# EAGLE schematic sensorboard (EAGLE 5.03)
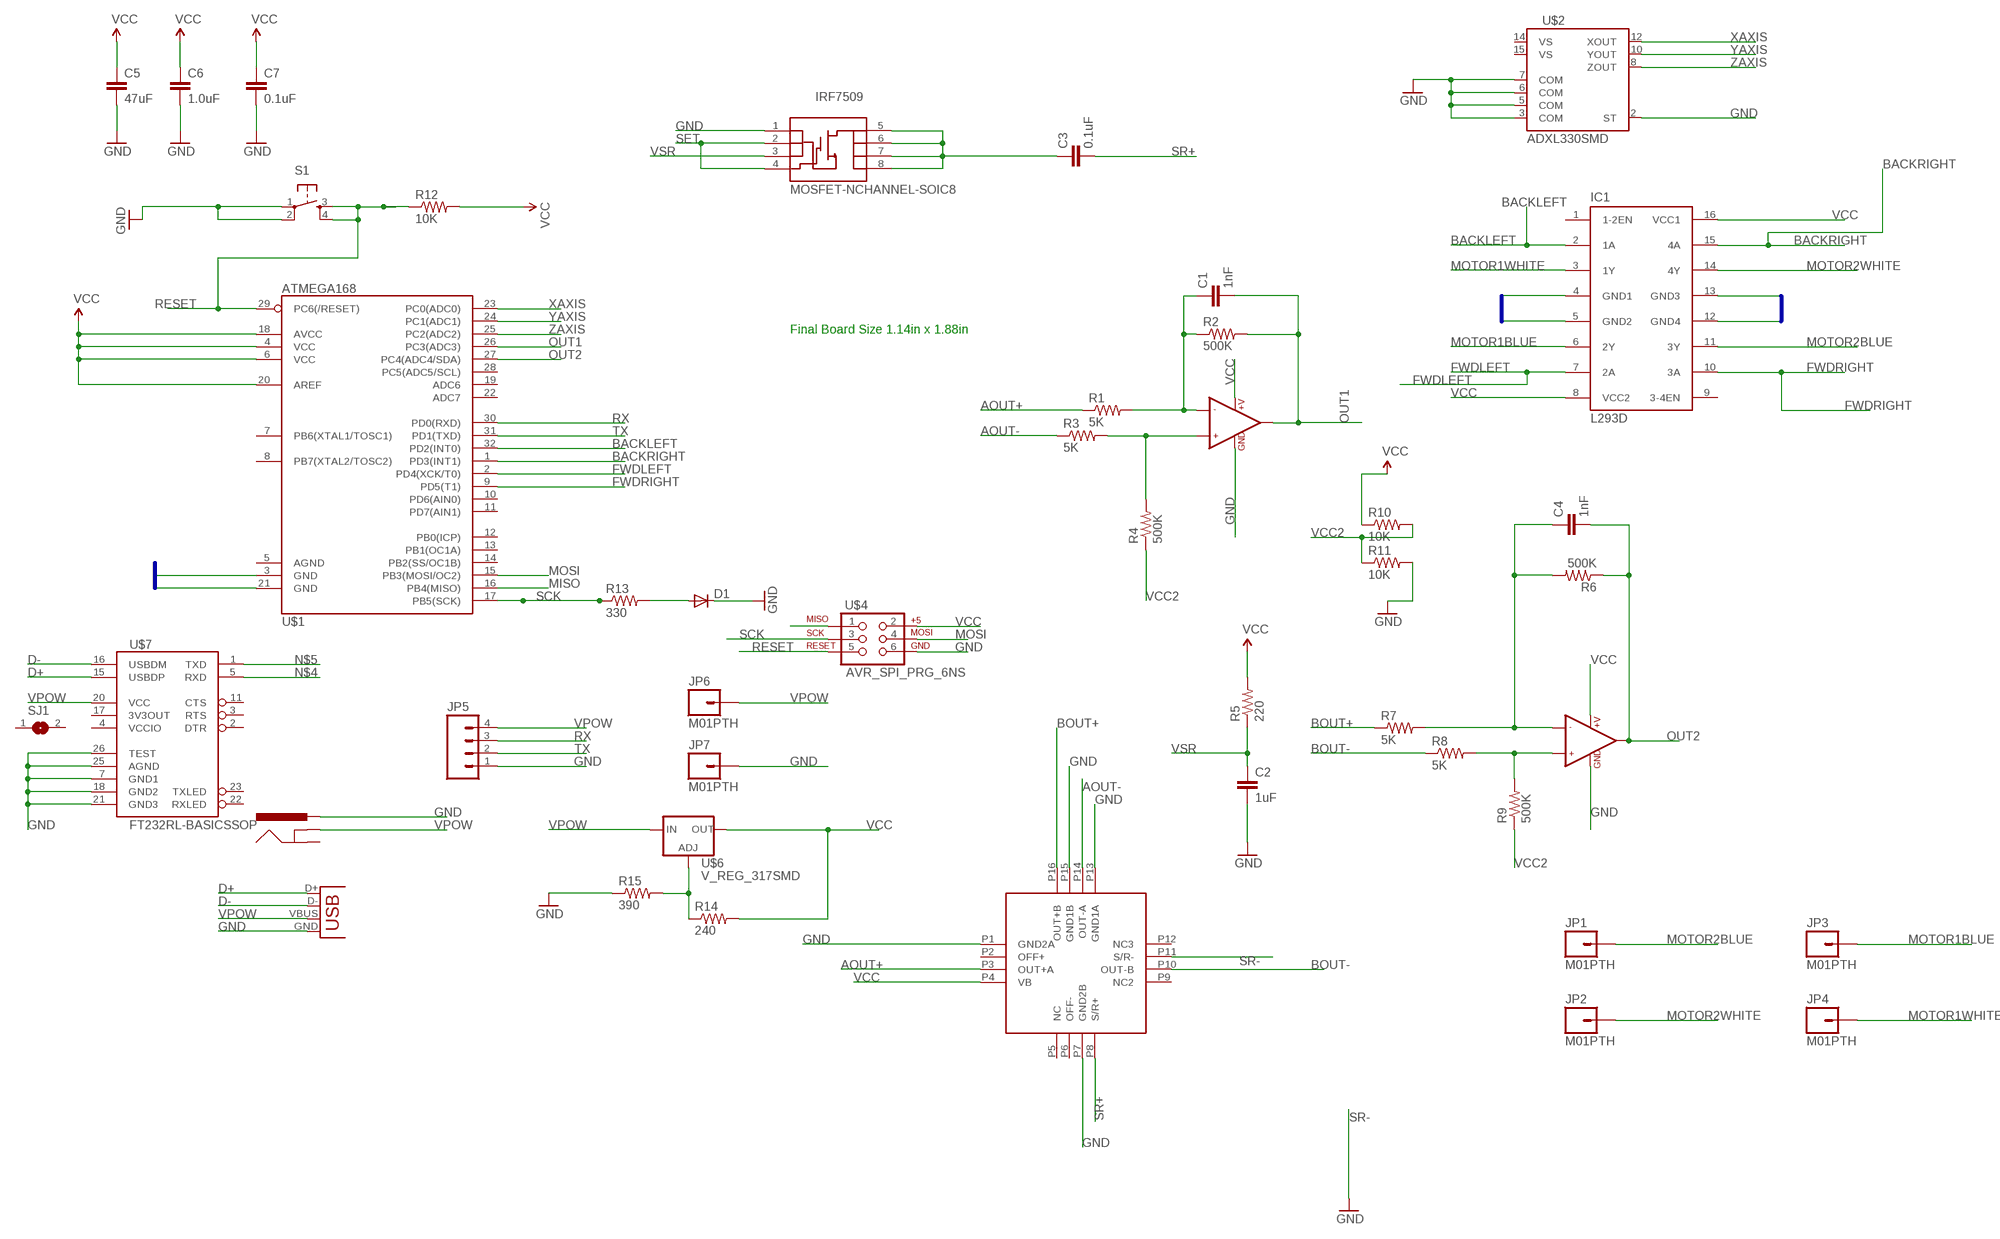
[diagram p0: schematic, sheet 1]

## Parts
C1  1nF  CAP0805  [0805]
C2  1uF  CAP0805  [0805]
C3  0.1uF  CAP0603  [0603]
C4  1nF  CAP0603  [0603]
C5  47uF  CAP0805  [0805]
C6  1.0uF  CAP0805  [0805]
C7  0.1uF  CAP0805  [0805]
D1  DIODESOT23  [SOT23-3]
IC1  L293D  [DIL16]
IRF7509  MOSFET-NCHANNEL-SOIC8  [SO08]
J1  POWER_JACKCOMBO  [POWER_JACK_COMBO]
JP1  M01PTH  [1X01]
JP2  M01PTH  [1X01]
JP3  M01PTH  [1X01]
JP4  M01PTH  [1X01]
JP5  M04PTH  [1X04]
JP6  M01PTH  [1X01]
JP7  M01PTH  [1X01]
LMV351$1  LMV358  [SO08]
R1  5K  RESISTOR1206  [1206]
R2  500K  RESISTOR1206  [1206]
R3  5K  RESISTOR1206  [1206]
R4  500K  RESISTOR1206  [1206]
R5  220  RESISTOR1206  [1206]
R6  500K  RESISTOR1206  [1206]
R7  5K  RESISTOR1206  [1206]
R8  5K  RESISTOR1206  [1206]
R9  500K  RESISTOR1206  [1206]
R10  10K  RESISTOR1206  [1206]
R11  10K  RESISTOR1206  [1206]
R12  10K  RESISTOR1206  [1206]
R13  330  RESISTOR1206  [1206]
R14  240  RESISTOR1206  [1206]
R15  390  RESISTOR1206  [1206]
S1  TAC_SWITCHSMD  [TACTILE_SWITCH_SMD]
SJ1  SJ  [SJ]
U$1  ATMEGA168  [TQFP32-08]
U$2  ADXL330SMD  [LFCSP-16]
U$3  HMC1052L  [16LPCC]
U$4  AVR_SPI_PRG_6NS  [2X3-NS]
U$5  LMV358  [SO08]
U$6  V_REG_317SMD  [SOT223]
U$7  FT232RL-BASICSSOP  [SSOP28DB]
X1  USBSMD  [USB-MINIB]

## Nets
AOUT+: R1.1 U$3.P3(OUT+A)
AOUT-: R3.1 U$3.P14(OUT-A)
BACKLEFT: IC1.2(1A) U$1.32(PD2(INT0))
BACKRIGHT: IC1.15(4A) U$1.1(PD3(INT1))
BOUT+: R7.1 U$3.P16(OUT+B)
BOUT-: R8.1 U$3.P10(OUT-B)
D+: U$7.15(USBDP) X1.D+
D-: U$7.16(USBDM) X1.D-
FWDLEFT: IC1.7(2A) U$1.2(PD4(XCK/T0))
FWDRIGHT: IC1.10(3A) U$1.9(PD5(T1))
GND: C2.2 C5.2 C6.2 C7.2 D1.3(C) IC1.4(GND1) IC1.5(GND2) IC1.12(GND4) IC1.13(GND3) IRF7509.1(S) J1.POWER(PWR) JP5.1 JP7.1 LMV351$1.4(GND) R11.2 R15.1 S1.1 S1.2 U$1.3(GND) U$1.21(GND) U$2.2(ST) U$2.3(COM) U$2.5(COM) U$2.6(COM) U$2.7(COM) U$3.P1(GND2A) U$3.P7(GND2B) U$3.P13(GND1A) U$3.P15(GND1B) U$4.6 U$5.4(GND) U$7.7(GND1) U$7.18(GND2) U$7.21(GND3) U$7.25(AGND) U$7.26(TEST) X1.GND
LMV358: C1.1 LMV351$1.2(-IN1) R1.2 R2.1
MISO: U$1.16(PB4(MISO)) U$4.1
MOSI: U$1.15(PB3(MOSI/OC2)) U$4.4
MOTOR1BLUE: IC1.6(2Y) JP3.1
MOTOR1WHITE: IC1.3(1Y) JP4.1
MOTOR2BLUE: IC1.11(3Y) JP1.1
MOTOR2WHITE: IC1.14(4Y) JP2.1
N$1: D1.1(A) R13.2
N$3: R14.1 R15.2 U$6.1(ADJ)
N$4: U$7.5(RXD)
N$5: U$7.1(TXD)
N$6: C3.1 IRF7509.5(D) IRF7509.6(D) IRF7509.7(D) IRF7509.8(D)
N$7: C4.1 R6.2 R7.2 U$5.2(-IN1)
N$8: LMV351$1.3(+IN1) R3.2 R4.2
N$9: R8.2 R9.2 U$5.3(+IN1)
OUT1: C1.2 LMV351$1.1(OUT1) R2.2 U$1.26(PC3(ADC3))
OUT2: C4.2 R6.1 U$1.27(PC4(ADC4/SDA)) U$5.1(OUT1)
RESET: R12.1 S1.3 S1.4 U$1.29(PC6(/RESET)) U$4.5
RX: JP5.3 U$1.30(PD0(RXD))
SCK: R13.1 U$1.17(PB5(SCK)) U$4.3
SET: IRF7509.2(S) IRF7509.4(G)
SR+: C3.2 U$3.P8(S/R+)
SR-: U$3.P11(S/R-) ; supply symbol labelled GND
TX: JP5.2 U$1.31(PD1(TXD))
VCC: C5.1 C6.1 C7.1 IC1.8(VCC2) IC1.16(VCC1) LMV351$1.8(+V) R5.2 R10.1 R12.2 R14.2 U$1.4(VCC) U$1.6(VCC) U$1.18(AVCC) U$1.20(AREF) U$3.P4(VB) U$4.2 U$5.8(+V) U$6.2(OUT)
VCC2: R4.1 R9.1 R10.2 R11.1
VPOW: J1.GND(GNDBREAK) JP5.4 JP6.1 U$6.3(IN) U$7.20(VCC) X1.VBUS
VSR: C2.1 IRF7509.3(S) R5.1
XAXIS: U$1.23(PC0(ADC0)) U$2.12(XOUT)
YAXIS: U$1.24(PC1(ADC1)) U$2.10(YOUT)
ZAXIS: U$1.25(PC2(ADC2)) U$2.8(ZOUT)
Unconnected: IC1.1(1-2EN) IC1.9(3-4EN) J1.GND@1(GND) LMV351$1.5(+IN2) LMV351$1.6(-IN2) LMV351$1.7(OUT2) SJ1.1 SJ1.2 U$1.5(AGND) U$1.7(PB6(XTAL1/TOSC1)) U$1.8(PB7(XTAL2/TOSC2)) U$1.10(PD6(AIN0)) U$1.11(PD7(AIN1)) U$1.12(PB0(ICP)) U$1.13(PB1(OC1A)) U$1.14(PB2(SS/OC1B)) U$1.19(ADC6) U$1.22(ADC7) U$1.28(PC5(ADC5/SCL)) U$2.14(VS) U$2.15(VS) U$3.P2(OFF+) U$3.P5(NC) U$3.P6(OFF-) U$3.P9(NC2) U$3.P12(NC3) U$5.5(+IN2) U$5.6(-IN2) U$5.7(OUT2) U$7.2(DTR) U$7.3(RTS) U$7.11(CTS) U$7.17(3V3OUT) U$7.22(RXLED) U$7.23(TXLED)

## Buses
GND

## Notes on the sheet
- Final Board Size 1.14in x 1.88in

## Power pins joined to a net without a drawn wire
VCCIO: U$7.4(VCCIO)

## Library data of the parts
C1-C7 = SparkFun:CAP: Capacitor Standard 0603 ceramic capacitor, and 0.1" leaded capacitor.
D1 = SparkFun:DIODE: Diode These are standard reverse protection diodes and small signal diodes. SMA package can handle up to about 1A. SOD-323 can handle about 200mA. What the SOD-323 package when ordering, there are some mfgs out there that are 5-pin packages.
IC1 = st-microelectronics:L293D: PUSH-PULL 4 CHANNEL DRIVER
IRF7509 = SparkFun:MOSFET-NCHANNEL-SOIC8: N-Channel MOSFET IRF9410 and NDS8434 are common, SOIC-8 parts.
J1 = SparkFun:POWER_JACK: Power Jack This is the standard 5.5mm barrel jack for power. The PTH is the most common, proven, reliable, footprint. All others are experimental. The Slot footprint only works if the mill layer is transmitted to the PCB fab house so be warned. Spark Fun Electronics SKU : PRT-00119. Mating wall wart : TOL-00298 (and others)
JP1-JP4 JP6 JP7 = SparkFun:M01: Header 1 Standard 1-pin 0.1" header. Use with straight break away headers (SKU : PRT-00116), right angle break away headers (PRT-00553), swiss pins (PRT-00743), machine pins (PRT-00117), and female headers (PRT-00115).
JP5 = SparkFun:M04: Header 4 Standard 4-pin 0.1" header. Use with straight break away headers (SKU : PRT-00116), right angle break away headers (PRT-00553), swiss pins (PRT-00743), machine pins (PRT-00117), and female headers (PRT-00115). Molex polarized connector foot print use with SKU : PRT-08231 with associated crimp pins and housings.
LMV351$1 U$5 = SparkFun:LMV358
R1-R15 = SparkFun:RESISTOR: Resistor Basic schematic elements and footprints for 0603, 1206, and PTH 1/10th watt (small) resistors.
S1 = SparkFun:TAC_SWITCH: Momentary Switch Button commonly used for reset or general input. Spark Fun Electronics SKU : COM-00097
SJ1 = jumper:SJ: SMD solder JUMPER
U$1 = SparkFun:ATMEGA168
U$2 = SparkFun:ADXL330: Triple Axis Accelerometer Analog Devices ADXL330 +/-3g 2.4V-5.25V Analog output. Spark Fun Electronics SKU : COM-00730. Center pad paste layer has been reduced to avoid shorting.
U$3 = SparkFun:HMC1052L: HMC1052L Dual axis magnetic sensor. Used for compass and magnetometer applications. Schematic and footprint are not tested and probably need fixing. Spark Fun Electronics SKU : COM-00708
U$4 = SparkFun:AVR_SPI_PRG_6: AVR ISP 6 Pin This is the reduced ISP connector for AVR programming. Common on Arduino. This footprint will take up less PCB space and can be used with a 10-pin to 6-pin adapter such as SKU: BOB-08508
U$6 = SparkFun:V_REG_317: Voltage Regulator Standard LM317 adjustable voltage regulator. AOI (Adjust Output Input). Google 'LM317 Calculator' for easy to use app to get the two resistor values needed. 240/720 for 5V output. 240/390 for 3.3V output. Spark Fun Electronics SKU : COM-00527
U$7 = SparkFun:FT232RL-BASIC: USB UART This is the simplified version of the FT232RL unit. Only what you need, nothing you don't. Spark Fun Electronics SKU : COM-00650
X1 = SparkFun:USB: USB Connectors USB-B-PTH is fully proven SKU : PRT-00139 USB-miniB is fully proven SKU : PRT-00587 USB-A-PCB is untested. USB-A-H is throughly reviewed, but untested. Spark Fun Electronics SKU : PRT-00437 USB-B-SMT is throughly reviewed, but untested. Needs silkscreen touching up. USB-A-S has not been used/tested USB-MB-H has not been used/tested